# Altium project 5100.PrjPCB
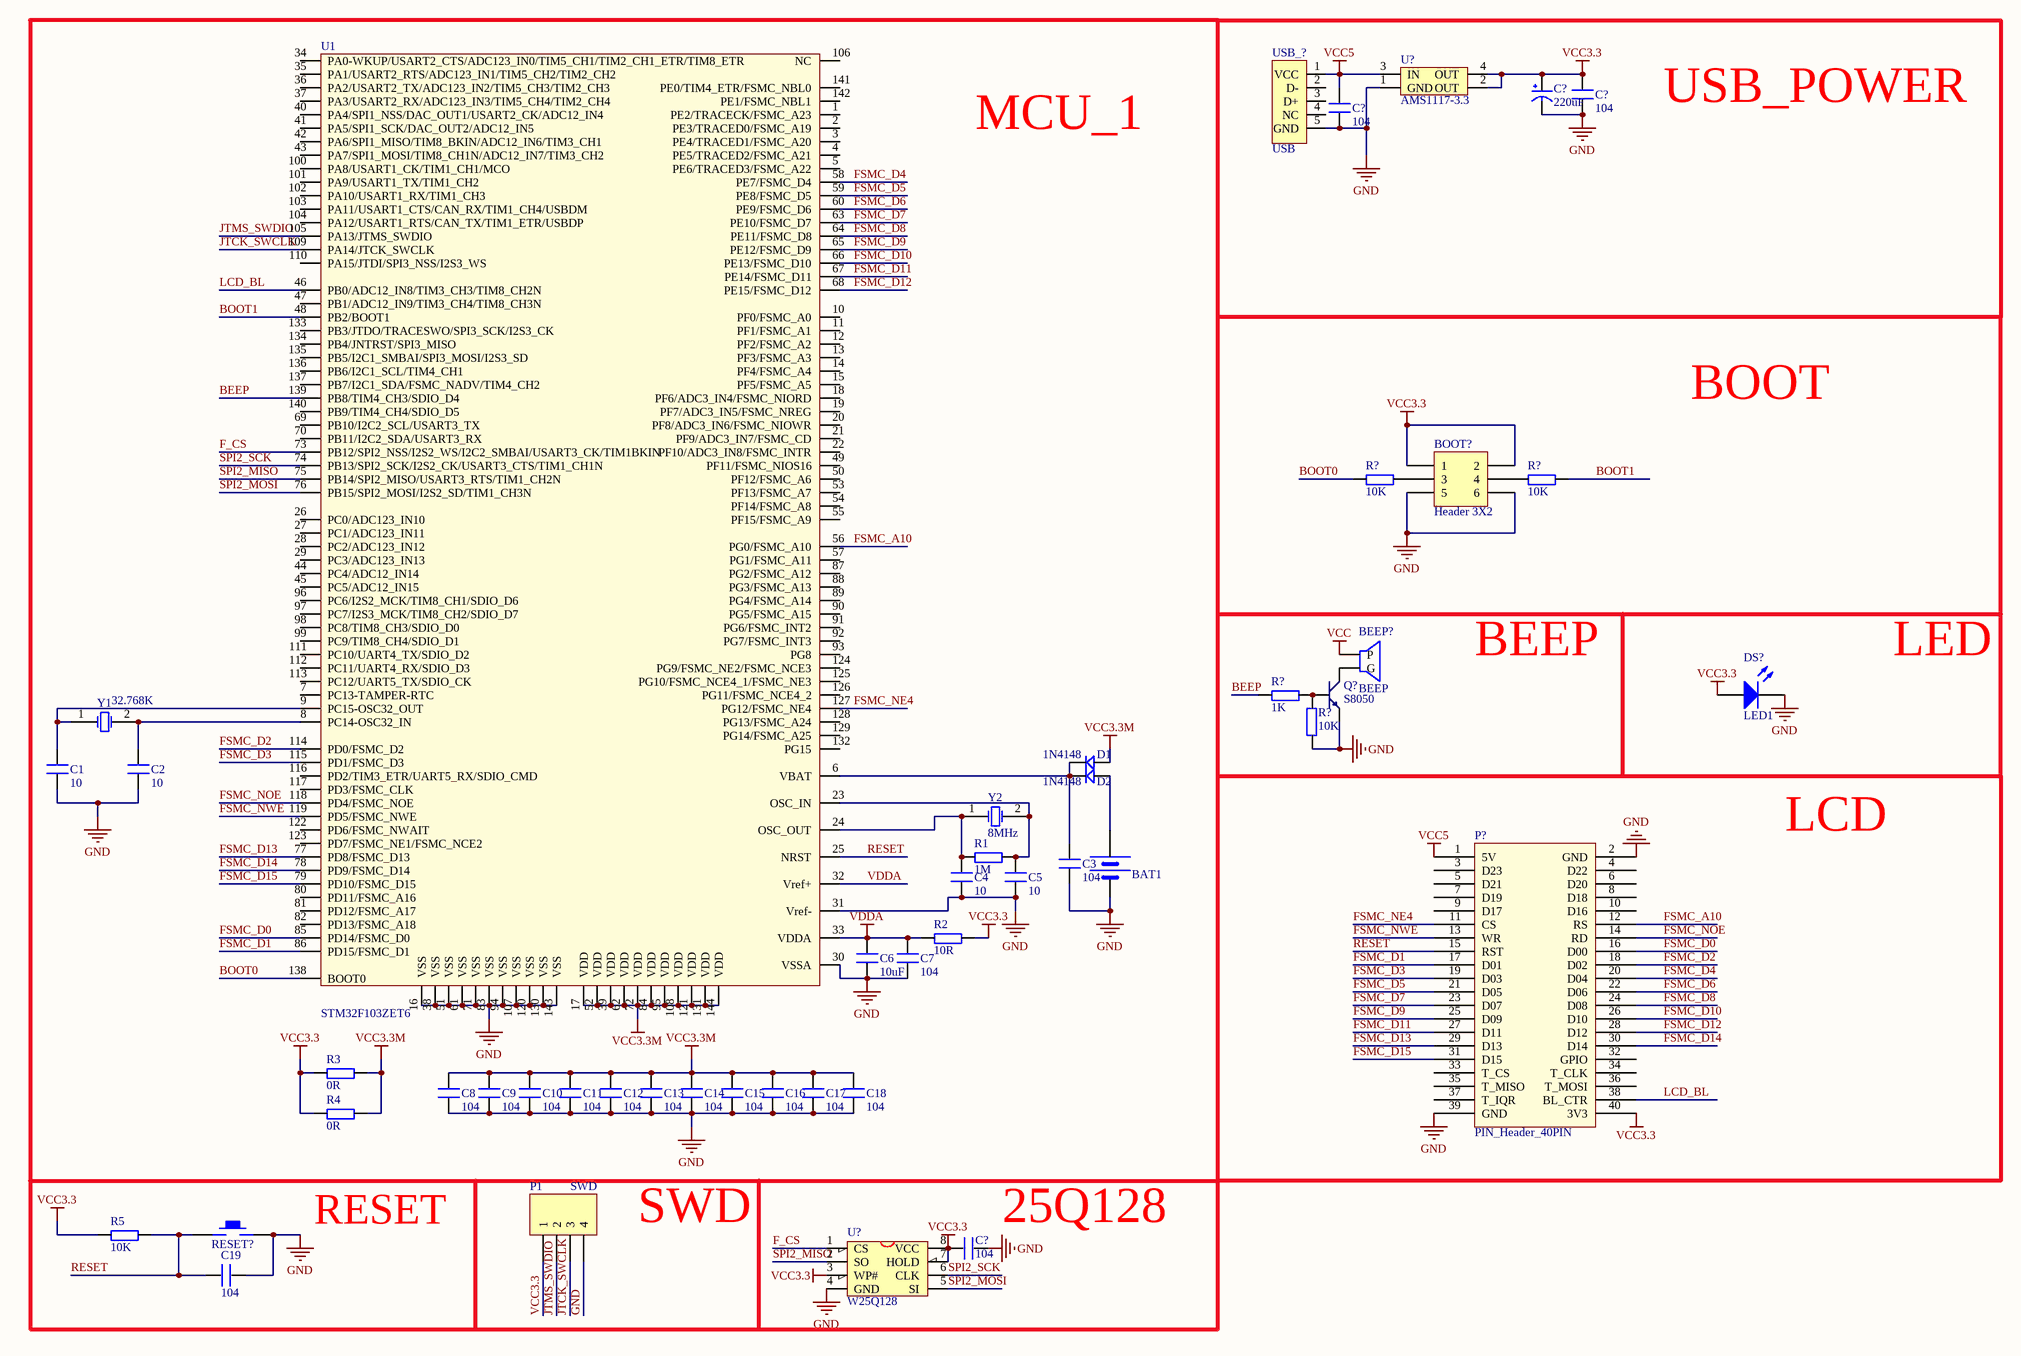
[diagram p0: 5100.SchDoc]
2 sheets, 48 parts. Net scope: global (net labels, ports and power ports of the same name join across sheets).
Board file: 5100.PcbDoc
Sheets:
  5100.SchDoc
  BatteryPower.SchDoc

## Sheet 5100.SchDoc
size A2

### Parts
(Parts that share a designator on the sheet are numbered #1, #2 ... from top to bottom, then left to right.)
BAT1  BATT  [BATM]  (value not drawn)
BEEP?  BEEP  [BELL-5]
BOOT?  Header 3X2  [HDR2X3]
C1  10  [0603P]
C2  10  [0603P]
C3  104  [0603P]
C4  10  [0603P]
C5  10  [0603P]
C6  10uF  [0805]
C7  104  [0603P]
C8  104  [0603P]
C9  104  [0603P]
C10  104  [0603P]
C11  104  [0603P]
C12  104  [0603P]
C13  104  [0603P]
C14  104  [0603P]
C15  104  [0603P]
C16  104  [0603P]
C17  104  [0603P]
C18  104  [0603P]
C19  104  [0603P]
C?#1  220uF  [CC6.56.5]
C?#2  104  [0603P]
C?#3  104  [0603P]
C?#4  104  [0603P]
D1  1N4148  [DIODE_SOP]
D2  1N4148  [DIODE_SOP]
DS?  LED1  [SMDLED]
P1  SWD  [HDR1X4]
P?  PIN_Header_40PIN  [P_Head_2x20]
Q?  S8050  [SOT-23R]
R1  1M  [0603P]
R2  10R  [0603P]
R3  0R  [0603P]
R4  0R  [0603P]
R5  10K  [0603P]
R?#1  10K  [0603P]
R?#2  10K  [0603P]
R?#3  10K  [0603P]
R?#4  1K  [0603P]
RESET?  KEY_M  [KEY_M]  (value not drawn)
U1  STM32F103ZET6  [LQFP144]
U?#1  AMS1117-3.3  [AMS1117]
U?#2  W25Q128  [SOIC-8]
USB_?  USB  [USB/SM0.8-6H5]
Y1  32.768K  [XTAL32]
Y2  8MHz  [XTAL_US]

### Blocks framed on the sheet
MCU_1: BAT1 C1-C18 D1 D2 R1-R4 U1 Y1 Y2

### Nets
GND: BAT1.2(GND) BOOT?.5 BOOT?.6 C1.1 C2.1 C3.1 C4.1 C5.1 C6.1 C7.1 C8.2 C9.2 C10.2 C11.2 C12.2 C13.2 C14.2 C15.2 C16.2 C17.2 C18.1 C19.2 C?#1.2(GND) C?#2.1 C?#3.1 C?#4.2 DS?.2(K) P1.4 P?.2(GND) P?.39(GND) Q?.1(E) R?#3.2 RESET?.2 U1.16(VSS) U1.30(VSSA) U1.31(Vref-) U1.38(VSS) U1.51(VSS) U1.61(VSS) U1.71(VSS) U1.83(VSS) U1.94(VSS) U1.107(VSS) U1.120(VSS) U1.130(VSS) U1.143(VSS) U?#1.1(GND) U?#2.4(GND) USB_?.5(GND)
VCC: BEEP?.1(P)
VCC3.3: BOOT?.1 BOOT?.2 C?#1.1(VCC) C?#2.2 C?#4.1 DS?.1(A) P1.1 P?.40(3V3) R2.2 R3.1 R4.1 R5.1 U?#1.2(OUT) U?#1.4(OUT) U?#2.3(WP#) U?#2.7(HOLD) U?#2.8(VCC)
VCC3.3M: C8.1 C9.1 C10.1 C11.1 C12.1 C13.1 C14.1 C15.1 C16.1 C17.1 C18.2 D1.1 R3.2 R4.2 U1.17(VDD) U1.39(VDD) U1.52(VDD) U1.62(VDD) U1.72(VDD) U1.84(VDD) U1.95(VDD) U1.108(VDD) U1.121(VDD) U1.131(VDD) U1.144(VDD)
VCC5: C?#3.2 P?.1(5V) U?#1.3(IN) USB_?.1(VCC)
VDDA: C6.2 C7.2 R2.1 U1.32(Vref+) U1.33(VDDA)
BEEP: R?#4.1 U1.139(PB8/TIM4_CH3/SDIO_D4)
BOOT0: R?#1.1 U1.138(BOOT0)
BOOT1: R?#2.2 U1.48(PB2/BOOT1)
F_CS: U1.73(PB12/SPI2_NSS/I2S2_WS/I2C2_SMBAI/USART3_CK/TIM1BKIN) U?#2.1(CS)
FSMC_A10: P?.12(RS) U1.56(PG0/FSMC_A10)
FSMC_D0: P?.16(D00) U1.85(PD14/FSMC_D0)
FSMC_D1: P?.17(D01) U1.86(PD15/FSMC_D1)
FSMC_D2: P?.18(D02) U1.114(PD0/FSMC_D2)
FSMC_D3: P?.19(D03) U1.115(PD1/FSMC_D3)
FSMC_D4: P?.20(D04) U1.58(PE7/FSMC_D4)
FSMC_D5: P?.21(D05) U1.59(PE8/FSMC_D5)
FSMC_D6: P?.22(D06) U1.60(PE9/FSMC_D6)
FSMC_D7: P?.23(D07) U1.63(PE10/FSMC_D7)
FSMC_D8: P?.24(D08) U1.64(PE11/FSMC_D8)
FSMC_D9: P?.25(D09) U1.65(PE12/FSMC_D9)
FSMC_D10: P?.26(D10) U1.66(PE13/FSMC_D10)
FSMC_D11: P?.27(D11) U1.67(PE14/FSMC_D11)
FSMC_D12: P?.28(D12) U1.68(PE15/FSMC_D12)
FSMC_D13: P?.29(D13) U1.77(PD8/FSMC_D13)
FSMC_D14: P?.30(D14) U1.78(PD9/FSMC_D14)
FSMC_D15: P?.31(D15) U1.79(PD10/FSMC_D15)
FSMC_NE4: P?.11(CS) U1.127(PG12/FSMC_NE4)
FSMC_NOE: P?.14(RD) U1.118(PD4/FSMC_NOE)
FSMC_NWE: P?.13(WR) U1.119(PD5/FSMC_NWE)
JTCK_SWCLK: P1.3 U1.109(PA14/JTCK_SWCLK)
JTMS_SWDIO: P1.2 U1.105(PA13/JTMS_SWDIO)
LCD_BL: P?.38(BL_CTR) U1.46(PB0/ADC12_IN8/TIM3_CH3/TIM8_CH2N)
RESET: C19.1 P?.15(RST) R5.2 RESET?.1 U1.25(NRST)
SPI2_MISO: U1.75(PB14/SPI2_MISO/USART3_RTS/TIM1_CH2N) U?#2.2(SO)
SPI2_MOSI: U1.76(PB15/SPI2_MOSI/I2S2_SD/TIM1_CH3N) U?#2.5(SI)
SPI2_SCK: U1.74(PB13/SPI2_SCK/I2S2_CK/USART3_CTS/TIM1_CH1N) U?#2.6(CLK)
NetBAT1_1: BAT1.1(VCC) D2.1
NetBEEP?_2: BEEP?.2(G) Q?.3(C)
NetBOOT?_3: BOOT?.3 R?#1.2
NetBOOT?_4: BOOT?.4 R?#2.1
NetC1_2: C1.2 U1.9(PC15-OSC32_OUT) Y1.1(OSC1)
NetC2_2: C2.2 U1.8(PC14-OSC32_IN) Y1.2(OSC2)
NetC3_2: C3.2 D1.2 D2.2 U1.6(VBAT)
NetC4_2: C4.2 R1.1 U1.24(OSC_OUT) Y2.1(OSC1)
NetC5_2: C5.2 R1.2 U1.23(OSC_IN) Y2.2(OSC2)
NetQ?_2: Q?.2(B) R?#3.1 R?#4.2

Not connected (* = marked no-connect by the designer): P? 3(D23) 4(D22) 5(D21) 6(D20) 7(D19) 8(D18) 9(D17) 10(D16) 32(GPIO) 33(T_CS) 34(T_CLK) 35(T_MISO) 36(T_MOSI) 37(T_IQR); U1 1(PE2/TRACECK/FSMC_A23) 2(PE3/TRACED0/FSMC_A19) 3(PE4/TRACED1/FSMC_A20) 4(PE5/TRACED2/FSMC_A21) 5(PE6/TRACED3/FSMC_A22) 7(PC13-TAMPER-RTC) 10(PF0/FSMC_A0) 11(PF1/FSMC_A1) 12(PF2/FSMC_A2) 13(PF3/FSMC_A3) 14(PF4/FSMC_A4) 15(PF5/FSMC_A5) 18(PF6/ADC3_IN4/FSMC_NIORD) 19(PF7/ADC3_IN5/FSMC_NREG) 20(PF8/ADC3_IN6/FSMC_NIOWR) 21(PF9/ADC3_IN7/FSMC_CD) 22(PF10/ADC3_IN8/FSMC_INTR) 26(PC0/ADC123_IN10) 27(PC1/ADC123_IN11) 28(PC2/ADC123_IN12) 29(PC3/ADC123_IN13) 34(PA0-WKUP/USART2_CTS/ADC123_IN0/TIM5_CH1/TIM2_CH1_ETR/TIM8_ETR) 35(PA1/USART2_RTS/ADC123_IN1/TIM5_CH2/TIM2_CH2) 36(PA2/USART2_TX/ADC123_IN2/TIM5_CH3/TIM2_CH3) 37(PA3/USART2_RX/ADC123_IN3/TIM5_CH4/TIM2_CH4) 40(PA4/SPI1_NSS/DAC_OUT1/USART2_CK/ADC12_IN4) 41(PA5/SPI1_SCK/DAC_OUT2/ADC12_IN5) 42(PA6/SPI1_MISO/TIM8_BKIN/ADC12_IN6/TIM3_CH1) 43(PA7/SPI1_MOSI/TIM8_CH1N/ADC12_IN7/TIM3_CH2) 44(PC4/ADC12_IN14) 45(PC5/ADC12_IN15) 47(PB1/ADC12_IN9/TIM3_CH4/TIM8_CH3N) 49(PF11/FSMC_NIOS16) 50(PF12/FSMC_A6) 53(PF13/FSMC_A7) 54(PF14/FSMC_A8) 55(PF15/FSMC_A9) 57(PG1/FSMC_A11) 69(PB10/I2C2_SCL/USART3_TX) 70(PB11/I2C2_SDA/USART3_RX) 80(PD11/FSMC_A16) 81(PD12/FSMC_A17) 82(PD13/FSMC_A18) 87(PG2/FSMC_A12) 88(PG3/FSMC_A13) 89(PG4/FSMC_A14) 90(PG5/FSMC_A15) 91(PG6/FSMC_INT2) 92(PG7/FSMC_INT3) 93(PG8) 96(PC6/I2S2_MCK/TIM8_CH1/SDIO_D6) 97(PC7/I2S3_MCK/TIM8_CH2/SDIO_D7) 98(PC8/TIM8_CH3/SDIO_D0) 99(PC9/TIM8_CH4/SDIO_D1) 100(PA8/USART1_CK/TIM1_CH1/MCO) 101(PA9/USART1_TX/TIM1_CH2) 102(PA10/USART1_RX/TIM1_CH3) 103(PA11/USART1_CTS/CAN_RX/TIM1_CH4/USBDM) 104(PA12/USART1_RTS/CAN_TX/TIM1_ETR/USBDP) 106(NC) 110(PA15/JTDI/SPI3_NSS/I2S3_WS) 111(PC10/UART4_TX/SDIO_D2) 112(PC11/UART4_RX/SDIO_D3) 113(PC12/UART5_TX/SDIO_CK) 116(PD2/TIM3_ETR/UART5_RX/SDIO_CMD) 117(PD3/FSMC_CLK) 122(PD6/FSMC_NWAIT) 123(PD7/FSMC_NE1/FSMC_NCE2) 124(PG9/FSMC_NE2/FSMC_NCE3) 125(PG10/FSMC_NCE4_1/FSMC_NE3) 126(PG11/FSMC_NCE4_2) 128(PG13/FSMC_A24) 129(PG14/FSMC_A25) 132(PG15) 133(PB3/JTDO/TRACESWO/SPI3_SCK/I2S3_CK) 134(PB4/JNTRST/SPI3_MISO) 135(PB5/I2C1_SMBAI/SPI3_MOSI/I2S3_SD) 136(PB6/I2C1_SCL/TIM4_CH1) 137(PB7/I2C1_SDA/FSMC_NADV/TIM4_CH2) 140(PB9/TIM4_CH4/SDIO_D5) 141(PE0/TIM4_ETR/FSMC_NBL0) 142(PE1/FSMC_NBL1); USB_? 2(D-) 3(D+) 4(NC)

### Notes on the sheet
- USB_POWER
- BOOT
- BEEP
- LED
- LCD
- RESET
- SWD
- (near C?#4) 25Q128

### Library data of the parts
BAT1 = BAT
BOOT? = Header 3X2: Header, 3-Pin, Dual row; LatestRevisionDate: 17-Jul-2002; LatestRevisionNote: Re-released for DXP Platform.; Publisher: Altium Limited
C1-C3 C7-C19 C?#2-C?#4 = C
C4 C5 = C_1
C6 = C_2
C?#1 = CAP
D1 D2 = D
DS? = LED2: Typical RED, GREEN, YELLOW, AMBER GaAs LED; Published: 8-Jun-2000; LatestRevisionDate: 17-Jul-2002; LatestRevisionNote: Re-released for DXP Platform.; PackageDocument: Feb-2002; PackageReference: 3.2X1.6X1.1; Publisher: Altium Limited
P1 = Header 4: Header, 4-Pin; LatestRevisionDate: 17-Jul-2002; LatestRevisionNote: Re-released for DXP Platform.; Publisher: Altium Limited
Q? = NPN: 8050/BCW846/BCW847
R1 R5 R?#1-R?#4 = R
R2 R3 = R_1
R4 = R_2
U?#1 = AMS1117
U?#2 = W25X16: W25X16;SST25VF016;MX25L1605
USB_? = USB5
Y1 = XTAL_1: Crystal Oscillator; Published: 8-Jun-2000; LatestRevisionDate: 17-Jul-2002; LatestRevisionNote: Re-released for DXP Platform.; Publisher: Altium Limited
Y2 = XTAL: Crystal Oscillator; Published: 8-Jun-2000; LatestRevisionDate: 17-Jul-2002; LatestRevisionNote: Re-released for DXP Platform.; Publisher: Altium Limited

## Sheet BatteryPower.SchDoc
size A4